# Altium schematic sheet 3.ADC.SchDoc
size A3; SheetNumber: 4; SheetTotal: 10
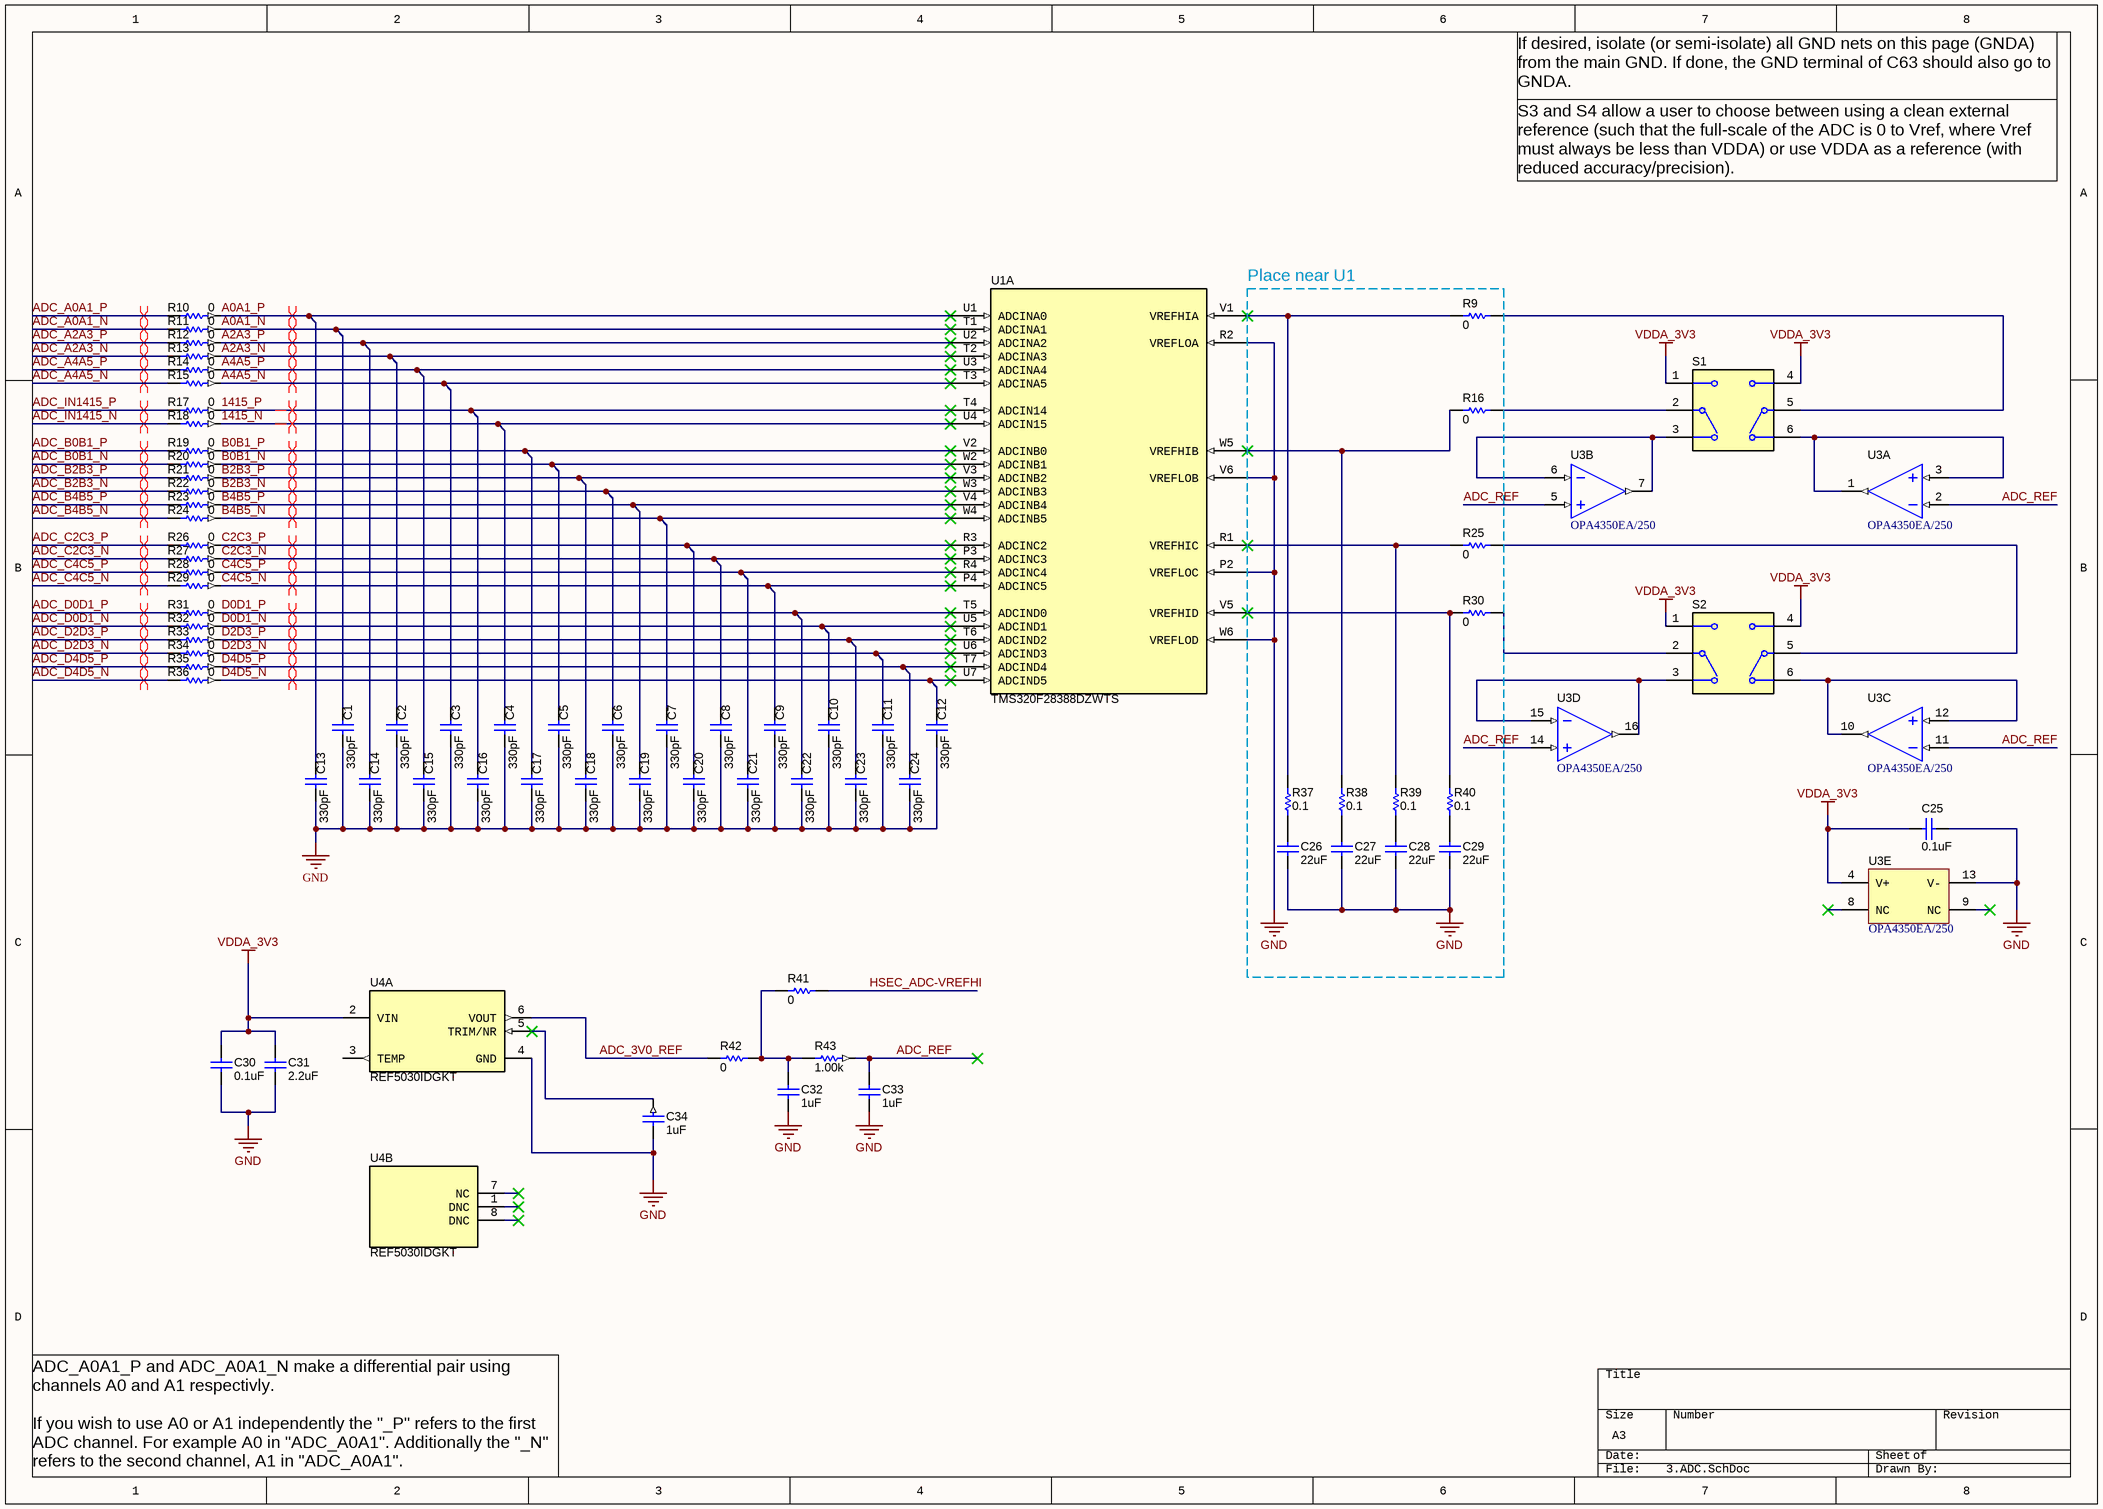
[diagram p0: 3.ADC.SchDoc]

## Parts
C1  ValueDisplayed: 330pF  [0603]  (hidden comment: C0603C331J5GACTU)
C2  ValueDisplayed: 330pF  [0603]  (hidden comment: C0603C331J5GACTU)
C3  ValueDisplayed: 330pF  [0603]  (hidden comment: C0603C331J5GACTU)
C4  ValueDisplayed: 330pF  [0603]  (hidden comment: C0603C331J5GACTU)
C5  ValueDisplayed: 330pF  [0603]  (hidden comment: C0603C331J5GACTU)
C6  ValueDisplayed: 330pF  [0603]  (hidden comment: C0603C331J5GACTU)
C7  ValueDisplayed: 330pF  [0603]  (hidden comment: C0603C331J5GACTU)
C8  ValueDisplayed: 330pF  [0603]  (hidden comment: C0603C331J5GACTU)
C9  ValueDisplayed: 330pF  [0603]  (hidden comment: C0603C331J5GACTU)
C10  ValueDisplayed: 330pF  [0603]  (hidden comment: C0603C331J5GACTU)
C11  ValueDisplayed: 330pF  [0603]  (hidden comment: C0603C331J5GACTU)
C12  ValueDisplayed: 330pF  [0603]  (hidden comment: C0603C331J5GACTU)
C13  ValueDisplayed: 330pF  [0603]  (hidden comment: C0603C331J5GACTU)
C14  ValueDisplayed: 330pF  [0603]  (hidden comment: C0603C331J5GACTU)
C15  ValueDisplayed: 330pF  [0603]  (hidden comment: C0603C331J5GACTU)
C16  ValueDisplayed: 330pF  [0603]  (hidden comment: C0603C331J5GACTU)
C17  ValueDisplayed: 330pF  [0603]  (hidden comment: C0603C331J5GACTU)
C18  ValueDisplayed: 330pF  [0603]  (hidden comment: C0603C331J5GACTU)
C19  ValueDisplayed: 330pF  [0603]  (hidden comment: C0603C331J5GACTU)
C20  ValueDisplayed: 330pF  [0603]  (hidden comment: C0603C331J5GACTU)
C21  ValueDisplayed: 330pF  [0603]  (hidden comment: C0603C331J5GACTU)
C22  ValueDisplayed: 330pF  [0603]  (hidden comment: C0603C331J5GACTU)
C23  ValueDisplayed: 330pF  [0603]  (hidden comment: C0603C331J5GACTU)
C24  ValueDisplayed: 330pF  [0603]  (hidden comment: C0603C331J5GACTU)
C25  ValueDisplayed: 0.1uF  [0603]  (hidden comment: C0603C104K8RACTU)
C26  ValueDisplayed: 22uF  [0603]  (hidden comment: GRM188R61A226ME15D)
C27  ValueDisplayed: 22uF  [0603]  (hidden comment: GRM188R61A226ME15D)
C28  ValueDisplayed: 22uF  [0603]  (hidden comment: GRM188R61A226ME15D)
C29  ValueDisplayed: 22uF  [0603]  (hidden comment: GRM188R61A226ME15D)
C30  ValueDisplayed: 0.1uF  [0603]  (hidden comment: C0603C104K8RACTU)
C31  ValueDisplayed: 2.2uF  [0603]  (hidden comment: C0603C225K9PACTU)
C32  ValueDisplayed: 1uF  [0603]  (hidden comment: C0603C105Z9VACTU)
C33  ValueDisplayed: 1uF  [0603]  (hidden comment: C0603C105Z9VACTU)
C34  ValueDisplayed: 1uF  [0603]  (hidden comment: C0603C105Z9VACTU)
R9  ValueDisplayed: 0  [0603]  (hidden comment: CRCW06030000Z0EA)
R10  ValueDisplayed: 0  [0603]  (hidden comment: CRCW06030000Z0EA)
R11  ValueDisplayed: 0  [0603]  (hidden comment: CRCW06030000Z0EA)
R12  ValueDisplayed: 0  [0603]  (hidden comment: CRCW06030000Z0EA)
R13  ValueDisplayed: 0  [0603]  (hidden comment: CRCW06030000Z0EA)
R14  ValueDisplayed: 0  [0603]  (hidden comment: CRCW06030000Z0EA)
R15  ValueDisplayed: 0  [0603]  (hidden comment: CRCW06030000Z0EA)
R16  ValueDisplayed: 0  [0603]  (hidden comment: CRCW06030000Z0EA)
R17  ValueDisplayed: 0  [0603]  (hidden comment: CRCW06030000Z0EA)
R18  ValueDisplayed: 0  [0603]  (hidden comment: CRCW06030000Z0EA)
R19  ValueDisplayed: 0  [0603]  (hidden comment: CRCW06030000Z0EA)
R20  ValueDisplayed: 0  [0603]  (hidden comment: CRCW06030000Z0EA)
R21  ValueDisplayed: 0  [0603]  (hidden comment: CRCW06030000Z0EA)
R22  ValueDisplayed: 0  [0603]  (hidden comment: CRCW06030000Z0EA)
R23  ValueDisplayed: 0  [0603]  (hidden comment: CRCW06030000Z0EA)
R24  ValueDisplayed: 0  [0603]  (hidden comment: CRCW06030000Z0EA)
R25  ValueDisplayed: 0  [0603]  (hidden comment: CRCW06030000Z0EA)
R26  ValueDisplayed: 0  [0603]  (hidden comment: CRCW06030000Z0EA)
R27  ValueDisplayed: 0  [0603]  (hidden comment: CRCW06030000Z0EA)
R28  ValueDisplayed: 0  [0603]  (hidden comment: CRCW06030000Z0EA)
R29  ValueDisplayed: 0  [0603]  (hidden comment: CRCW06030000Z0EA)
R30  ValueDisplayed: 0  [0603]  (hidden comment: CRCW06030000Z0EA)
R31  ValueDisplayed: 0  [0603]  (hidden comment: CRCW06030000Z0EA)
R32  ValueDisplayed: 0  [0603]  (hidden comment: CRCW06030000Z0EA)
R33  ValueDisplayed: 0  [0603]  (hidden comment: CRCW06030000Z0EA)
R34  ValueDisplayed: 0  [0603]  (hidden comment: CRCW06030000Z0EA)
R35  ValueDisplayed: 0  [0603]  (hidden comment: CRCW06030000Z0EA)
R36  ValueDisplayed: 0  [0603]  (hidden comment: CRCW06030000Z0EA)
R37  ValueDisplayed: 0.1  [0402]  (hidden comment: ERJ2BWFR100X)
R38  ValueDisplayed: 0.1  [0402]  (hidden comment: ERJ2BWFR100X)
R39  ValueDisplayed: 0.1  [0402]  (hidden comment: ERJ2BWFR100X)
R40  ValueDisplayed: 0.1  [0402]  (hidden comment: ERJ2BWFR100X)
R41  ValueDisplayed: 0  [0603]  (hidden comment: CRCW06030000Z0EA)
R42  ValueDisplayed: 0  [0603]  (hidden comment: CRCW06030000Z0EA)
R43  ValueDisplayed: 1.00k  [0603]  (hidden comment: RC0603FR-071KL)
S1  CAS-D20TA  [SW_CAS-D20TA]  (value not drawn)
S2  CAS-D20TA  [SW_CAS-D20TA]  (value not drawn)
U1  TMS320F28388DZWTS  [ZWT0337A-IPC_B]  (part A of 5)
U3  OPA4350EA/250  [DBQ0016A_N]  (parts A,B,C,D,E of 5)
U4  REF5030IDGKT  [DGK0008A_N]  (parts A,B of 2)

## Nets
GND: C1.2 C2.2 C3.2 C4.2 C5.2 C6.2 C7.2 C8.2 C9.2 C10.2 C11.2 C12.2 C13.2 C14.2 C15.2 C16.2 C17.2 C18.2 C19.2 C20.2 C21.2 C22.2 C23.2 C24.2 C25.1 C26.2 C27.2 C28.2 C29.2 C30.2 C31.2 C32.2 C33.2 C34.2 U1.P2(VREFLOC) U1.R2(VREFLOA) U1.V6(VREFLOB) U1.W6(VREFLOD) U3.13(V-) U4.4(GND)
VDDA_3V3: C25.2 C30.1 C31.1 S1.1 S1.4 S2.1 S2.4 U3.4(V+) U4.2(VIN)
1415_N: C4.1 R18.1 U1.U4(ADCIN15)
1415_P: C16.1 R17.1 U1.T4(ADCIN14)
A0A1_N: C1.1 R11.1 U1.T1(ADCINA1)
A0A1_P: C13.1 R10.1 U1.U1(ADCINA0)
A2A3_N: C2.1 R13.1 U1.T2(ADCINA3)
A2A3_P: C14.1 R12.1 U1.U2(ADCINA2)
A4A5_N: C3.1 R15.1 U1.T3(ADCINA5)
A4A5_P: C15.1 R14.1 U1.U3(ADCINA4)
ADC_3V0_REF: R42.2 U4.6(VOUT)
ADC_A0A1_N: R11.2
ADC_A0A1_P: R10.2
ADC_A2A3_N: R13.2
ADC_A2A3_P: R12.2
ADC_A4A5_N: R15.2
ADC_A4A5_P: R14.2
ADC_B0B1_N: R20.2
ADC_B0B1_P: R19.2
ADC_B2B3_N: R22.2
ADC_B2B3_P: R21.2
ADC_B4B5_N: R24.2
ADC_B4B5_P: R23.2
ADC_C2C3_N: R27.2
ADC_C2C3_P: R26.2
ADC_C4C5_N: R29.2
ADC_C4C5_P: R28.2
ADC_D0D1_N: R32.2
ADC_D0D1_P: R31.2
ADC_D2D3_N: R34.2
ADC_D2D3_P: R33.2
ADC_D4D5_N: R36.2
ADC_D4D5_P: R35.2
ADC_IN1415_N: R18.2
ADC_IN1415_P: R17.2
ADC_REF: C33.1 R43.2 U3.2(IN_A-) U3.5(IN_B+) U3.11(IN_C-) U3.14(IN_D+)
B0B1_N: C5.1 R20.1 U1.W2(ADCINB1)
B0B1_P: C17.1 R19.1 U1.V2(ADCINB0)
B2B3_N: C6.1 R22.1 U1.W3(ADCINB3)
B2B3_P: C18.1 R21.1 U1.V3(ADCINB2)
B4B5_N: C7.1 R24.1 U1.W4(ADCINB5)
B4B5_P: C19.1 R23.1 U1.V4(ADCINB4)
C2C3_N: C8.1 R27.1 U1.P3(ADCINC3)
C2C3_P: C20.1 R26.1 U1.R3(ADCINC2)
C4C5_N: C9.1 R29.1 U1.P4(ADCINC5)
C4C5_P: C21.1 R28.1 U1.R4(ADCINC4)
D0D1_N: C10.1 R32.1 U1.U5(ADCIND1)
D0D1_P: C22.1 R31.1 U1.T5(ADCIND0)
D2D3_N: C11.1 R34.1 U1.U6(ADCIND3)
D2D3_P: C23.1 R33.1 U1.T6(ADCIND2)
D4D5_N: C12.1 R36.1 U1.U7(ADCIND5)
D4D5_P: C24.1 R35.1 U1.T7(ADCIND4)
HSEC_ADC-VREFHI: R41.1
NetC26_1: C26.1 R37.2
NetC27_1: C27.1 R38.2
NetC28_1: C28.1 R39.2
NetC29_1: C29.1 R40.2
NetC32_1: C32.1 R41.2 R42.1 R43.1
NetC34_1: C34.1 U4.5(TRIM/NR)
NetR9_1: R9.1 S1.5(C)
NetR9_2: R9.2 R37.1 U1.V1(VREFHIA)
NetR16_1: R16.1 S1.2(C)
NetR16_2: R16.2 R38.1 U1.W5(VREFHIB)
NetR25_1: R25.1 S2.5(C)
NetR25_2: R25.2 R39.1 U1.R1(VREFHIC)
NetR30_1: R30.1 S2.2(C)
NetR30_2: R30.2 R40.1 U1.V5(VREFHID)
NetS1_3: S1.3 U3.6(IN_B-) U3.7(OUT_B)
NetS1_6: S1.6 U3.1(OUT_A) U3.3(IN_A+)
NetS2_3: S2.3 U3.15(IN_D-) U3.16(OUT_D)
NetS2_6: S2.6 U3.10(OUT_C) U3.12(IN_C+)

Not connected (* = marked no-connect by the designer): U3 8(NC)* 9(NC)*; U4 1(DNC)* 3(TEMP) 7(NC)* 8(DNC)*

## Layout directives
differential pair: 1415_N, 1415_P, A0A1_N, A0A1_P, A2A3_N, A2A3_P, A4A5_N, A4A5_P, ADC_A0A1_N, ADC_A0A1_P, ADC_A2A3_N, ADC_A2A3_P, ADC_A4A5_N, ADC_A4A5_P, ADC_B0B1_N, ADC_B0B1_P, ADC_B2B3_N, ADC_B2B3_P, ADC_B4B5_N, ADC_B4B5_P, ADC_C2C3_N, ADC_C2C3_P, ADC_C4C5_N, ADC_C4C5_P, ADC_D0D1_N, ADC_D0D1_P, ADC_D2D3_N, ADC_D2D3_P, ADC_D4D5_N, ADC_D4D5_P, ADC_IN1415_N, ADC_IN1415_P, B0B1_N, B0B1_P, B2B3_N, B2B3_P, B4B5_N, B4B5_P, C2C3_N, C2C3_P, C4C5_N, C4C5_P, D0D1_N, D0D1_P, D2D3_N, D2D3_P, D4D5_N, D4D5_P

## Notes on the sheet
- If desired, isolate (or semi-isolate) all GND nets on this page (GNDA) from the main GND. If done, the GND terminal of C63 should also go to GNDA.
- S3 and S4 allow a user to choose between using a clean external reference (such that the full-scale of the ADC is 0 to Vref, where Vref must always be less than VDDA) or use VDDA as a reference (with reduced accuracy/precision).
- (near U1) Place near U1
- ADC_A0A1_P and ADC_A0A1_N make a differential pair using channels A0 and A1 respectivly.
  If you wish to use A0 or A1 independently the "_P" refers to the first ADC channel. For example A0 in "ADC_A0A1". Additionally the "_N" refers to the second channel, A1 in "ADC_A0A1".

## Library data of the parts
C1-C24 = CMP-0006920-4: CAP, CERM, 330 pF, 50 V, +/- 5%, C0G/NP0, 0603; Manufacturer: Kemet; TaMin_C: -55°C; Polarized: N; SizeAreaWB_mm2: 4.68; Value1: Unknown; U/M: EA; Value: 330pF; TaMax_C: 125°C; SizeZ_mm: 1; SizeX_mm: 1.6; SizeY_mm: 0.8; Value2: 50V; SizeArea_mm2: 1.28; AEC Category: Q200; Supplier Part Number 2: 80-C0603C331J5G; Publisher: Texas Instruments; Supplier 2: Mouser; Supplier Part Number 3: 1414634; TempCo: C0G/NP0; Supplier 3: Farnell; Published: 2008-06-19; RoHS: Y; MountType: SMT; Supplier 1: Digi-Key; PackageReference: 0603; Tolerance_%: 5%; Cap_Case: 0603; CompType: Capacitor; LatestRevisionDate: 2017-03-09; PartNumber: C0603C331J5GACTU; AEC Qualified: ?; Cap_F: 330pF; ComponentLink1Description: Datasheet link; Supplier Part Number 1: 399-1068-1-ND; Technology: Ceramic; ComponentLink1URL: http://www.kemet.com/kemet/web/homepage/kechome.nsf/vapubfiles/F3102_Y5V.pdf/$file/F3102_Y5V.pdf
C25 C30 = CMP-0006862-5: CAP, CERM, 0.1 uF, 10 V, +/- 10%, X7R, 0603; Manufacturer: Kemet; TaMin_C: -55°C; Polarized: N; SizeAreaWB_mm2: 4.68; Value1: Unknown; U/M: EA; Value: 0.1uF; TaMax_C: 125°C; SizeZ_mm: 1; SizeX_mm: 1.6; SizeY_mm: 0.8; Value2: 10V; SizeArea_mm2: 1.28; Cap_F: 100nF; AEC Category: Q200; Supplier Part Number 2: 80-C0603C104K8R; Publisher: Texas Instruments; Supplier 2: Mouser; Supplier Part Number 3: 1640032; TempCo: X7R; Supplier 3: Farnell; Published: 2008-06-19; RoHS: Y; MountType: SMT; Supplier 1: Digi-Key; PackageReference: 0603; Tolerance_%: 10%; Cap_Case: 0603; CompType: Capacitor; LatestRevisionDate: 2017-03-09; PartNumber: C0603C104K8RACTU; AEC Qualified: ?; ComponentLink1Description: Datasheet link; Supplier Part Number 1: 399-1095-1-ND; Technology: Ceramic; ComponentLink1URL: http://www.kemet.com/kemet/web/homepage/kechome.nsf/vapubfiles/F3102_Y5V.pdf/$file/F3102_Y5V.pdf
C26-C29 = CMP-0007324-5: CAP, CERM, 22 uF, 10 V, +/- 20%, X5R, 0603; Manufacturer: MuRata; TaMin_C: -55°C; Polarized: N; SizeAreaWB_mm2: 4.68; Value1: Unknown; U/M: EA; Value: 22uF; TaMax_C: 85°C; SizeZ_mm: 1; SizeX_mm: 1.6; SizeY_mm: 0.8; Value2: 10V; SizeArea_mm2: 1.28; Cap_F: 22µF; AEC Category: Q200; Supplier Part Number 2: 68X2786; Publisher: Texas Instruments; Supplier 2: Newark; Supplier Part Number 3: 81-GRM188R61A226ME5D; TempCo: X5R; Supplier 3: Mouser; Published: 2008-06-19; RoHS: Y; MountType: SMT; Supplier 1: Digi-Key; PackageReference: 0603; Tolerance_%: 20%; Cap_Case: 0603; CompType: Capacitor; LatestRevisionDate: 2017-03-09; PartNumber: GRM188R61A226ME15D; AEC Qualified: ?; ComponentLink1Description: Datasheet link; Supplier Part Number 1: 490-10476-1-ND; Technology: Ceramic; ComponentLink1URL: http://psearch.murata.com/capacitor/product/GRM188R61A226ME15%23.pdf
C31 = CMP-0006907-5: CAP, CERM, 2.2 uF, 6.3 V, +/- 10%, X5R, 0603; Manufacturer: Kemet; TaMin_C: -55°C; Polarized: N; SizeAreaWB_mm2: 4.68; Value1: Unknown; U/M: EA; Value: 2.2uF; TaMax_C: 85°C; SizeZ_mm: 1; SizeX_mm: 1.6; SizeY_mm: 0.8; Value2: 6.3V; SizeArea_mm2: 1.28; Cap_F: 2.2µF; AEC Category: Q200; Supplier Part Number 2: 80-C0603C225K9P; Publisher: Texas Instruments; Supplier 2: Mouser; Supplier Part Number 3: 1288257; TempCo: X5R; Supplier 3: Farnell; Published: 2008-06-19; RoHS: Y; MountType: SMT; Supplier 1: Digi-Key; PackageReference: 0603; Tolerance_%: 10%; Cap_Case: 0603; CompType: Capacitor; LatestRevisionDate: 2017-03-09; PartNumber: C0603C225K9PACTU; AEC Qualified: ?; ComponentLink1Description: Datasheet link; Supplier Part Number 1: 399-3362-1-ND; Technology: Ceramic; ComponentLink1URL: http://www.kemet.com/kemet/web/homepage/kechome.nsf/vapubfiles/F3102_Y5V.pdf/$file/F3102_Y5V.pdf
C32-C34 = CMP-0006871-4: CAP, CERM, 1 uF, 6.3 V, +80/-20%, Y5V, 0603; Manufacturer: Kemet; TaMin_C: -30°C; Polarized: N; SizeAreaWB_mm2: 4.68; Value1: Unknown; U/M: EA; Value: 1uF; TaMax_C: 85°C; Tolerance_%: 80%; SizeZ_mm: 1; SizeX_mm: 1.6; SizeY_mm: 0.8; Value2: 6.3V; SizeArea_mm2: 1.28; Cap_F: 1µF; AEC Category: Q200; Supplier Part Number 2: 80-C0603C105Z9V; Publisher: Texas Instruments; Supplier 2: Mouser; Supplier Part Number 3: 1515067; TempCo: Y5V; Supplier 3: Farnell; Published: 2008-06-19; RoHS: Y; MountType: SMT; Supplier 1: Digi-Key; PackageReference: 0603; Cap_Case: 0603; CompType: Capacitor; LatestRevisionDate: 2017-03-09; PartNumber: C0603C105Z9VACTU; AEC Qualified: ?; ComponentLink1Description: Datasheet link; Supplier Part Number 1: 399-3217-1-ND; Technology: Ceramic; ComponentLink1URL: http://www.kemet.com/kemet/web/homepage/kechome.nsf/vapubfiles/F3102_Y5V.pdf/$file/F3102_Y5V.pdf
R9-R36 R41 R42 = CMP-0025697-4: RES, 0, 5%, 0.1 W, AEC-Q200 Grade 0, 0603; Manufacturer: Vishay-Dale; Value: 0; Value_Code: 0000; Power_W: 100mW; Value2: 0.1W; VDC_V: 75V; TempCo: 200 ppm/C; EIA_Code: E24; AEC Category: Q200; AEC Qualified: Y; SizeArea_mm2: 1.28; SizeX_mm: 1.6; SizeY_mm: 0.8; SizeZ_mm: 1; CompType: Resistor; PartNumber: CRCW06030000Z0EA; PackageReference: 0603; RoHS: E; Res_ohm: 0; Tolerance_%: 5%; Value1: 5%; MountType: SMT; Technology: Thick Film; ComponentLink1Description: Datasheet link; ComponentLink1URL: http://www.vishay.com/docs/20035/dcrcwe3.pdf; Supplier 1: Digi-Key; Supplier Part Number 1: 541-0.0GCT-ND; Supplier 2: Newark; Supplier Part Number 2: 52K8014; Supplier 3: Mouser; Supplier Part Number 3: 71-CRCW0603-0-E3; AEC Grade: 0
R37-R40 = CMP-0078660-1: RES, 0.1, 1%, 0.25 W, 0402; Manufacturer: Panasonic; Power_W: 250mW; TempCo: 300 ppm/C; Value_Code: R100; Value: 0.1; EIA_Code: E96; Res_ohm: 1d; SizeX_mm: 1; SizeY_mm: 0.5; SizeZ_mm: 0.6; Value2: 0.25W; AEC Qualified: N; AEC Category: Q200; ComponentLink1URL: https://industrial.panasonic.com/cdbs/www-data/pdf/RDN0000/AOA0000C313.pdf; Supplier Part Number 2: 667-ERJ-2BWFR100X; Supplier 2: Mouser; RoHS: Y; Value1: 1%; MountType: SMT; Supplier 1: Digi-Key; PackageReference: 0402; Tolerance_%: 1%; SizeArea_mm2: 0.5; CompType: Resistor; PartNumber: ERJ2BWFR100X; ComponentLink1Description: Datasheet link; AEC Grade: N/A; Supplier Part Number 1: P17368CT-ND; Technology: Thick Film
R43 = CMP-0022895-5: RES, 1.00 k, 1%, 0.1 W, 0603; Manufacturer: Yageo; Power_W: 100mW; TempCo: 100 ppm/C; Value_Code: 1k00; Value: 1.00k; EIA_Code: E96; Res_ohm: 1k; SizeX_mm: 1.6; SizeY_mm: 0.8; SizeZ_mm: 1; Value2: 0.1W; SizeArea_mm2: 1.28; AEC Qualified: N; VDC_V: 75V; AEC Category: Q200; SizeAreaWB_mm2: 4.68; Supplier Part Number 2: 603-RC0603FR-071KL; Supplier 2: Mouser; Supplier Part Number 3: 9238484; Supplier 3: Farnell; RoHS: Y; Value1: 1%; MountType: SMT; Supplier 1: Digi-Key; PackageReference: 0603; Tolerance_%: 1%; CompType: Resistor; PartNumber: RC0603FR-071KL; ComponentLink1Description: Datasheet link; Supplier Part Number 1: 311-1.00KHRCT-ND; Technology: Thick Film; ComponentLink1URL: http://www.yageo.com/pdf/Pu-RC0603_51_PbFree_L_2.pdf; AEC Grade: N/A
S1 S2 = CMP-0002233-1: Switch, Dual SPDT,  2 Pos, 0.1A, 6VDC, SMD; Manufacturer: Copal Electronics; CurrentRating_mA: 100A; SwitchFunction: On-On; VDC_V: 6V; PositionCount: 2; ComponentLink1Description: Datasheet Link; LatestRevisionDate: 2017-03-09; PackageReference: 5.4x3.9mm; Publisher: Texas Instruments; Supplier 1: Digi-Key; ComponentLink1URL: http://www.nidec-copal-electronics.com/e/catalog/switch/cas.pdf; Supplier Part Number 1: CASD20JCT-ND; MountType: SMT; Circuit: SPDT; Orientation: Top Actuated; PartNumber: CAS-D20TA; CompType: Switch; RoHS: Y
U1 = CMP-012-000147-1: TMS320F28388DZWTS, ZWT0337A (NFBGA-337); Alternate Manufacturer: Texas Instruments; SizeY_mm: 16; SizeArea_mm2: 256; AEC Qualified: N; SizeAreaWB_mm2: 324; SizeZ_mm: 1.4; Available Preview Images: 2D; CompType: IC; AEC Category: Q200; ComponentLink2URL: http://www.ti.com/product/tms320f28388d; MountType: SMT; ComponentLink3Description: Online Datasheet; PackageDescription: NFBGA-337; ComponentLink3URL: http://www.ti.com/product/tms320f28388d/datasheet; SizeX_mm: 16; Design Item ID: TMS320F28388DZWTS; ComponentLink1URL: http://www.ti.com/lit/ds/symlink/tms320f28388d.pdf; Source: SamacSys.SchLib; ComponentLink2Description: Product Folder; PackageReference: ZWT0337A; Manufacturer: Texas Instruments; ComponentLink1Description: Datasheet Link
U3 = CMP-014-00004-2: High-Speed, Single-Supply, Rail-to-Rail Operational Amplifier MicroAmplifier(TM) Series, 2.7 to 5.5 V, -55 to 150 degC, 16-pin SOP (DBQ16), Green (RoHS & no Sb/Br); Manufacturer: Texas Instruments; Sub Family: Low Input Bias Current Amp (<=10pA), Low Offset Voltage Amplifier (<=500uV), Low Supply Voltage Amplifier (<=2.7V), Precision Amplifier; Iq per channel(Max)(mA): 7.5; Slew Rate(Typ)(V/us): 22; Vn at 1kHz(Typ)(nV/rtHz): 18; CMRR(Min)(dB): 66; Available Preview Images: 2D; IIB(Max)(pA): 10; Total Supply Voltage(Min)(+5V is 5, +/-5V is 10): 2.7; Number of Channels: 4; Vio (25C)(Max)(mV): 0.5; Total Supply Voltage(Max)(+5V is 5, +/-5V is 10): 5.5; Eco-Plan: Green (RoHS & no Sb/Br); PackageVersion: 4073301-2/H, 10/2008; ComponentLink3URL: http://www.ti.com/litv/pdf/msoi004g; Mounting Technology: Surface Mount; ComponentLink2Description: Datasheet; ComponentLink1Description: Manufacturer URL; ComponentLink1URL: http://www.ti.com/; PackageReference: DBQ0016A; ComponentLink2URL: http://www.ti.com/general/docs/lit/getliterature.tsp?genericPartNumber=OPA4350&fileType=pdf; Code_JEDEC: MO-137; Design Item ID: CMP-0041147-1; DatasheetVersion: SBOS099C; Offset Drift(Typ)(uV/C): 4; Case/Package: 16-Pin, Plastic Small Outline, Body 3.9 x 4.9 mm, Pitch 0.635 mm; Source: SamacSys.SchLib; ComponentLink3Description: Package Specification
U4 = CMP-0032596-2: Low Noise, Very Low Drift, Precision Series Voltage Reference, DGK0008A (VSSOP-8); Manufacturer: Texas Instruments; Temp Coeff(Max)(ppm/ degree C): 3; Iout/Iz(Max)(mA): 10; VI(Min)(V): 3.2; Eco-Plan: Green (RoHS & no Sb/Br); Initial Accuracy @ 25/deg C(%): 0.05; Iq(Max)(uA): 1000; VI(Max)(V): 18; Rating: Catalog; AEC Category: Q200; AEC Qualified: N; CompType: IC; SizeAreaWB_mm2: 23.6; SizeArea_mm2: 14.7; SizeX_mm: 4.9; SizeZ_mm: 1.1; PackageDescription: VSSOP-8; ComponentLink3URL: http://www.ti.com/product/ref5030/datasheet; PackageVersion: 4073329/E; DatasheetVersion: SBOS410E; VO(V): 3; PartNumber: REF5030IDGKT; ComponentLink3Description: Online Datasheet; ComponentLink2URL: http://www.ti.com/product/ref5030; ComponentLink1Description: Datasheet Link; Code_JEDEC: MO-187-AA; PackageReference: DGK0008A; SubFamily: Series Voltage Reference; ComponentLink1URL: http://www.ti.com/lit/ds/symlink/ref5030.pdf; ComponentLink2Description: Product Folder; MountType: SMT; RoHS: Y; SizeY_mm: 3